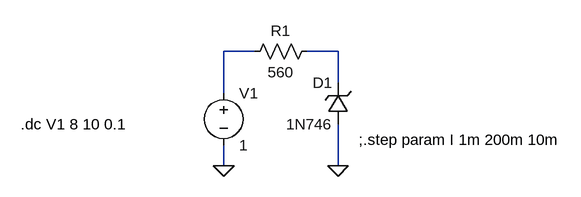
[diagram p0: schematic Test 1N746.asc]
Test 1N746.asc, the LTspice schematic file:
Version 4
SHEET 1 880 680
WIRE 128 112 80 112
WIRE 256 112 208 112
WIRE 256 160 256 112
WIRE 80 176 80 112
WIRE 80 288 80 256
WIRE 256 288 256 224
FLAG 256 288 0
FLAG 80 288 0
SYMBOL zener 272 224 R180
WINDOW 0 24 64 Left 2
WINDOW 3 24 0 Left 2
SYMATTR InstName D1
SYMATTR Value 1N746
SYMBOL voltage 80 160 R0
WINDOW 123 0 0 Left 0
WINDOW 39 0 0 Left 0
SYMATTR InstName V1
SYMATTR Value 1
SYMBOL res 224 96 R90
WINDOW 0 0 56 VBottom 2
WINDOW 3 32 56 VTop 2
SYMATTR InstName R1
SYMATTR Value 560
TEXT 288 248 Left 2 !;.step param I 1m 200m 10m
TEXT -232 224 Left 2 !.dc V1 8 10 0.1

The netlist it stands for:
* Test 1N746.asc
D1 0 N002 1N746
V1 N001 0 1
R1 N002 N001 560
.model D D
.lib standard.dio
;.step param I 1m 200m 10m
.dc V1 8 10 0.1
.backanno
.end